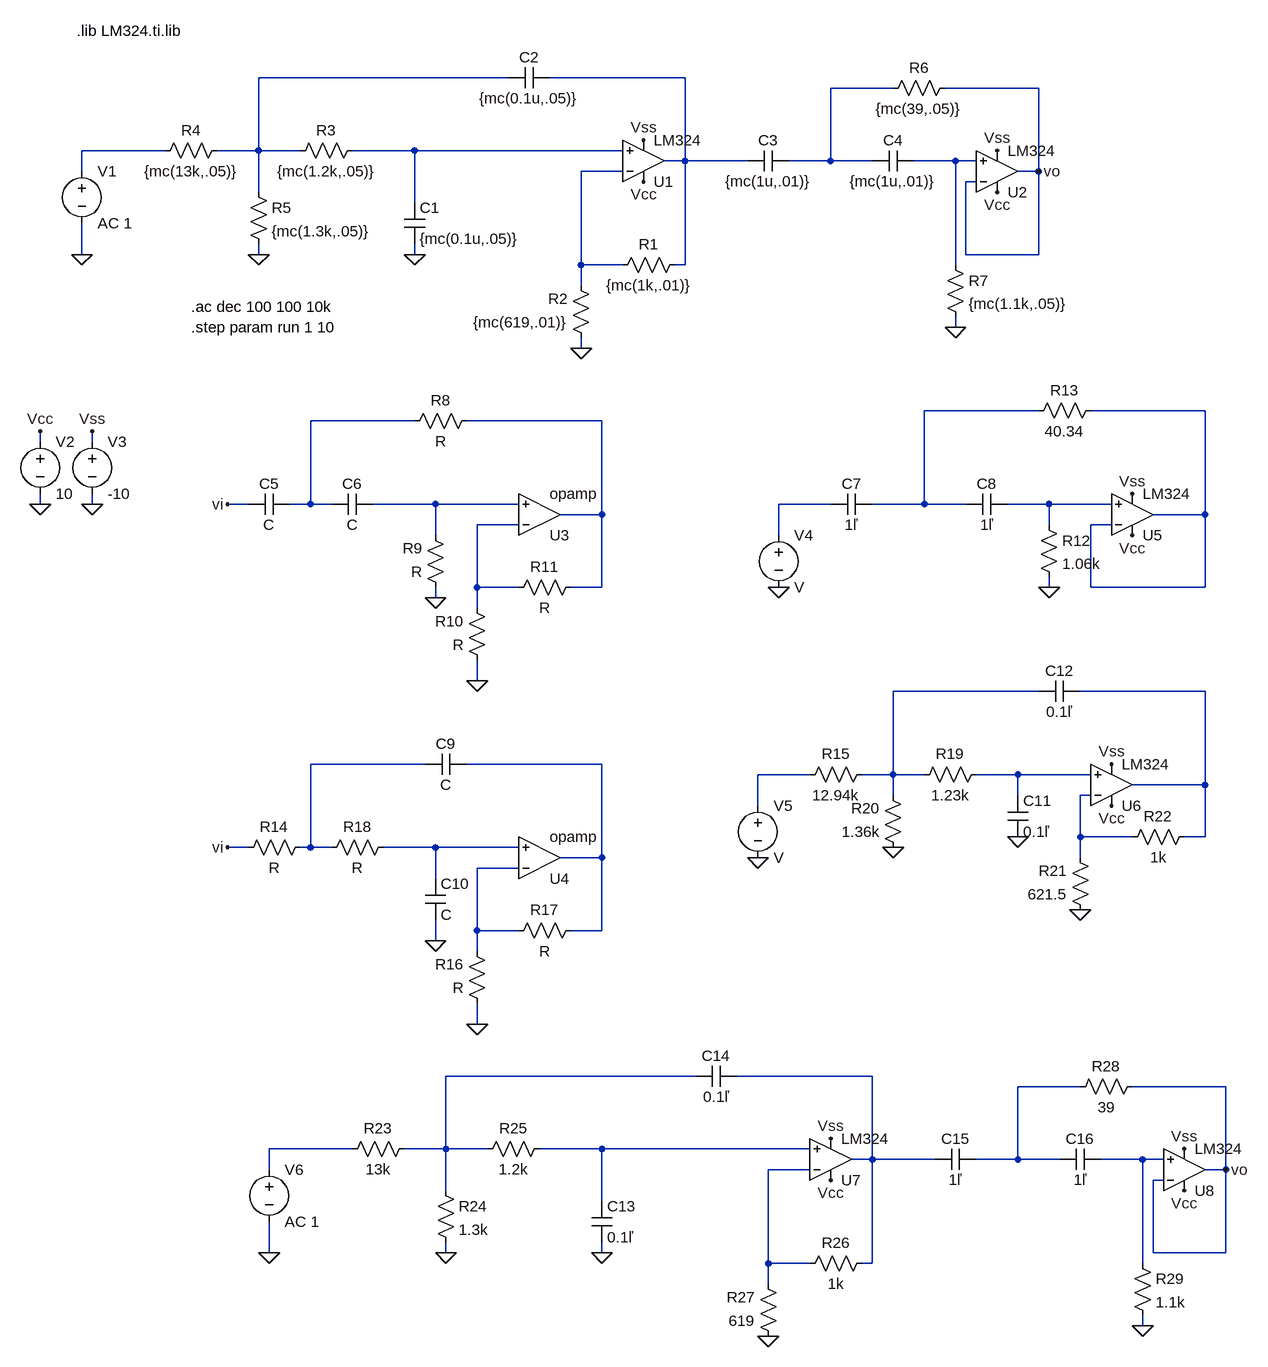
[diagram p0: schematic TP4_MORALES_SUAREZ_TORRES.asc]
TP4_MORALES_SUAREZ_TORRES.asc, the LTspice schematic file:
Version 4.1
SHEET 1 1472 2004
WIRE 176 48 -208 48
WIRE 448 48 240 48
WIRE 768 64 672 64
WIRE 992 64 848 64
WIRE -352 160 -480 160
WIRE -208 160 -208 48
WIRE -208 160 -272 160
WIRE -144 160 -208 160
WIRE 32 160 -64 160
WIRE 352 160 32 160
WIRE 448 176 448 48
WIRE 448 176 416 176
WIRE 544 176 448 176
WIRE 672 176 672 64
WIRE 672 176 608 176
WIRE 736 176 672 176
WIRE 864 176 800 176
WIRE 896 176 864 176
WIRE -480 192 -480 160
WIRE 352 192 288 192
WIRE 992 192 992 64
WIRE 992 192 960 192
WIRE 896 208 880 208
WIRE -208 224 -208 160
WIRE 32 240 32 160
WIRE -480 320 -480 272
WIRE -208 320 -208 304
WIRE 32 320 32 304
WIRE 880 320 880 208
WIRE 992 320 992 192
WIRE 992 320 880 320
WIRE 288 336 288 192
WIRE 352 336 288 336
WIRE 448 336 448 176
WIRE 448 336 432 336
WIRE 864 336 864 176
WIRE 288 368 288 336
WIRE 864 432 864 416
WIRE 288 464 288 448
WIRE 992 560 816 560
WIRE 1248 560 1072 560
WIRE 32 576 -128 576
WIRE 320 576 112 576
WIRE -544 608 -544 592
WIRE -464 608 -464 592
WIRE -544 704 -544 688
WIRE -464 704 -464 688
WIRE -224 704 -256 704
WIRE -128 704 -128 576
WIRE -128 704 -160 704
WIRE -96 704 -128 704
WIRE 64 704 -32 704
WIRE 192 704 64 704
WIRE 672 704 592 704
WIRE 816 704 816 560
WIRE 816 704 736 704
WIRE 880 704 816 704
WIRE 1008 704 944 704
WIRE 1104 704 1008 704
WIRE 320 720 320 576
WIRE 320 720 256 720
WIRE 1248 720 1248 560
WIRE 1248 720 1168 720
WIRE 192 736 128 736
WIRE 1008 736 1008 704
WIRE 1104 736 1072 736
WIRE 64 752 64 704
WIRE 592 752 592 704
WIRE 128 832 128 736
WIRE 192 832 128 832
WIRE 320 832 320 720
WIRE 320 832 272 832
WIRE 1008 832 1008 816
WIRE 1072 832 1072 736
WIRE 1248 832 1248 720
WIRE 1248 832 1072 832
WIRE 64 848 64 832
WIRE 128 864 128 832
WIRE 128 976 128 944
WIRE 992 992 768 992
WIRE 1248 992 1056 992
WIRE 48 1104 -128 1104
WIRE 320 1104 112 1104
WIRE 640 1120 560 1120
WIRE 768 1120 768 992
WIRE 768 1120 720 1120
WIRE 816 1120 768 1120
WIRE 960 1120 896 1120
WIRE 1072 1120 960 1120
WIRE 1248 1136 1248 992
WIRE 1248 1136 1136 1136
WIRE 768 1152 768 1120
WIRE 960 1152 960 1120
WIRE 1072 1152 1056 1152
WIRE 560 1168 560 1120
WIRE 1056 1216 1056 1152
WIRE 1136 1216 1056 1216
WIRE 1248 1216 1248 1136
WIRE 1248 1216 1216 1216
WIRE -224 1232 -256 1232
WIRE -128 1232 -128 1104
WIRE -128 1232 -144 1232
WIRE -96 1232 -128 1232
WIRE 64 1232 -16 1232
WIRE 192 1232 64 1232
WIRE 320 1248 320 1104
WIRE 320 1248 256 1248
WIRE 1056 1248 1056 1216
WIRE 192 1264 128 1264
WIRE 64 1280 64 1232
WIRE 128 1360 128 1264
WIRE 192 1360 128 1360
WIRE 320 1360 320 1248
WIRE 320 1360 272 1360
WIRE 64 1376 64 1344
WIRE 128 1392 128 1360
WIRE 128 1504 128 1472
WIRE 464 1584 80 1584
WIRE 736 1584 528 1584
WIRE 1056 1600 960 1600
WIRE 1280 1600 1136 1600
WIRE -64 1696 -192 1696
WIRE 80 1696 80 1584
WIRE 80 1696 16 1696
WIRE 144 1696 80 1696
WIRE 320 1696 224 1696
WIRE 640 1696 320 1696
WIRE 736 1712 736 1584
WIRE 736 1712 704 1712
WIRE 832 1712 736 1712
WIRE 960 1712 960 1600
WIRE 960 1712 896 1712
WIRE 1024 1712 960 1712
WIRE 1152 1712 1088 1712
WIRE 1184 1712 1152 1712
WIRE -192 1728 -192 1696
WIRE 640 1728 576 1728
WIRE 1280 1728 1280 1600
WIRE 1280 1728 1248 1728
WIRE 1184 1744 1168 1744
WIRE 80 1760 80 1696
WIRE 320 1776 320 1696
WIRE -192 1856 -192 1808
WIRE 80 1856 80 1840
WIRE 320 1856 320 1840
WIRE 1168 1856 1168 1744
WIRE 1280 1856 1280 1728
WIRE 1280 1856 1168 1856
WIRE 576 1872 576 1728
WIRE 640 1872 576 1872
WIRE 736 1872 736 1712
WIRE 736 1872 720 1872
WIRE 1152 1872 1152 1712
WIRE 576 1904 576 1872
WIRE 1152 1968 1152 1952
FLAG -544 704 0
FLAG -464 704 0
FLAG -208 320 0
FLAG -480 320 0
FLAG 32 320 0
FLAG 288 464 0
FLAG 864 432 0
FLAG 384 208 Vcc
FLAG 384 144 Vss
FLAG 928 224 Vcc
FLAG 928 160 Vss
FLAG -544 592 Vcc
FLAG -464 592 Vss
FLAG 992 192 vo
FLAG -256 704 vi
FLAG 128 976 0
FLAG 64 848 0
FLAG 592 832 0
FLAG 1008 832 0
FLAG 1136 752 Vcc
FLAG 1136 688 Vss
FLAG -256 1232 vi
FLAG 128 1504 0
FLAG 64 1376 0
FLAG 1056 1328 0
FLAG 768 1232 0
FLAG 960 1216 0
FLAG 1104 1168 Vcc
FLAG 1104 1104 Vss
FLAG 560 1248 0
FLAG 80 1856 0
FLAG -192 1856 0
FLAG 320 1856 0
FLAG 1152 1968 0
FLAG 672 1744 Vcc
FLAG 672 1680 Vss
FLAG 1216 1760 Vcc
FLAG 1216 1696 Vss
FLAG 1280 1728 vo
FLAG 576 1984 0
SYMBOL voltage -544 592 R0
SYMATTR InstName V2
SYMATTR Value 10
SYMBOL voltage -464 592 R0
SYMATTR InstName V3
SYMATTR Value -10
SYMBOL res -256 144 R90
WINDOW 0 0 56 VBottom 2
WINDOW 3 32 56 VTop 2
SYMATTR InstName R4
SYMATTR Value {mc(13k,.05)}
SYMBOL res -224 208 R0
SYMATTR InstName R5
SYMATTR Value {mc(1.3k,.05)}
SYMBOL res -48 144 R90
WINDOW 0 0 56 VBottom 2
WINDOW 3 32 56 VTop 2
SYMATTR InstName R3
SYMATTR Value {mc(1.2k,.05)}
SYMBOL cap 16 240 R0
SYMATTR InstName C1
SYMATTR Value {mc(0.1u,.05)}
SYMBOL cap 240 32 R90
WINDOW 0 0 32 VBottom 2
WINDOW 3 32 32 VTop 2
SYMATTR InstName C2
SYMATTR Value {mc(0.1u,.05)}
SYMBOL voltage -480 176 R0
SYMATTR InstName V1
SYMATTR Value AC 1
SYMBOL res 448 320 R90
WINDOW 0 0 56 VBottom 2
WINDOW 3 32 56 VTop 2
SYMATTR InstName R1
SYMATTR Value {mc(1k,.01)}
SYMBOL res 304 464 R180
WINDOW 0 36 76 Left 2
WINDOW 3 36 40 Left 2
SYMATTR InstName R2
SYMATTR Value {mc(619,.01)}
SYMBOL cap 608 160 R90
WINDOW 0 0 32 VBottom 2
WINDOW 3 32 32 VTop 2
SYMATTR InstName C3
SYMATTR Value {mc(1u,.01)}
SYMBOL cap 800 160 R90
WINDOW 0 0 32 VBottom 2
WINDOW 3 32 32 VTop 2
SYMATTR InstName C4
SYMATTR Value {mc(1u,.01)}
SYMBOL res 864 48 R90
WINDOW 0 0 56 VBottom 2
WINDOW 3 32 56 VTop 2
SYMATTR InstName R6
SYMATTR Value {mc(39,.05)}
SYMBOL res 848 320 R0
SYMATTR InstName R7
SYMATTR Value {mc(1.1k,.05)}
SYMBOL OpAmps\\opamp2 384 240 M180
SYMATTR InstName U1
SYMATTR Value LM324
SYMBOL OpAmps\\opamp2 928 256 M180
SYMATTR InstName U2
SYMATTR Value LM324
SYMBOL cap -160 688 R90
WINDOW 0 0 32 VBottom 2
WINDOW 3 32 32 VTop 2
SYMATTR InstName C5
SYMBOL cap -32 688 R90
WINDOW 0 0 32 VBottom 2
WINDOW 3 32 32 VTop 2
SYMATTR InstName C6
SYMBOL res 128 560 R90
WINDOW 0 0 56 VBottom 2
WINDOW 3 32 56 VTop 2
SYMATTR InstName R8
SYMBOL res 80 848 R180
WINDOW 0 36 76 Left 2
WINDOW 3 36 40 Left 2
SYMATTR InstName R9
SYMBOL res 144 960 R180
WINDOW 0 36 76 Left 2
WINDOW 3 36 40 Left 2
SYMATTR InstName R10
SYMBOL res 176 848 R270
WINDOW 0 32 56 VTop 2
WINDOW 3 0 56 VBottom 2
SYMATTR InstName R11
SYMBOL OpAmps\\opamp 224 784 M180
SYMATTR InstName U3
SYMBOL voltage 592 736 R0
SYMATTR InstName V4
SYMBOL cap 736 688 R90
WINDOW 0 0 32 VBottom 2
WINDOW 3 32 32 VTop 2
SYMATTR InstName C7
SYMATTR Value 1ľ
SYMBOL cap 944 688 R90
WINDOW 0 0 32 VBottom 2
WINDOW 3 32 32 VTop 2
SYMATTR InstName C8
SYMATTR Value 1ľ
SYMBOL res 992 720 R0
SYMATTR InstName R12
SYMATTR Value 1.06k
SYMBOL OpAmps\\opamp2 1136 784 M180
SYMATTR InstName U5
SYMATTR Value LM324
SYMBOL res 1088 544 R90
WINDOW 0 0 56 VBottom 2
WINDOW 3 32 56 VTop 2
SYMATTR InstName R13
SYMATTR Value 40.34
SYMBOL res 144 1488 R180
WINDOW 0 36 76 Left 2
WINDOW 3 36 40 Left 2
SYMATTR InstName R16
SYMBOL res 176 1376 R270
WINDOW 0 32 56 VTop 2
WINDOW 3 0 56 VBottom 2
SYMATTR InstName R17
SYMBOL OpAmps\\opamp 224 1312 M180
SYMATTR InstName U4
SYMBOL res -128 1216 R90
WINDOW 0 0 56 VBottom 2
WINDOW 3 32 56 VTop 2
SYMATTR InstName R14
SYMBOL res 0 1216 R90
WINDOW 0 0 56 VBottom 2
WINDOW 3 32 56 VTop 2
SYMATTR InstName R18
SYMBOL cap 112 1088 R90
WINDOW 0 0 32 VBottom 2
WINDOW 3 32 32 VTop 2
SYMATTR InstName C9
SYMBOL cap 48 1280 R0
SYMATTR InstName C10
SYMBOL voltage 560 1152 R0
SYMATTR InstName V5
SYMBOL res 736 1104 R90
WINDOW 0 0 56 VBottom 2
WINDOW 3 32 56 VTop 2
SYMATTR InstName R15
SYMATTR Value 12.94k
SYMBOL res 912 1104 R90
WINDOW 0 0 56 VBottom 2
WINDOW 3 32 56 VTop 2
SYMATTR InstName R19
SYMATTR Value 1.23k
SYMBOL res 784 1248 R180
WINDOW 0 36 76 Left 2
WINDOW 3 36 40 Left 2
SYMATTR InstName R20
SYMATTR Value 1.36k
SYMBOL res 1072 1344 R180
WINDOW 0 36 76 Left 2
WINDOW 3 36 40 Left 2
SYMATTR InstName R21
SYMATTR Value 621.5
SYMBOL res 1120 1232 R270
WINDOW 0 32 56 VTop 2
WINDOW 3 0 56 VBottom 2
SYMATTR InstName R22
SYMATTR Value 1k
SYMBOL cap 944 1152 R0
SYMATTR InstName C11
SYMATTR Value 0.1ľ
SYMBOL OpAmps\\opamp2 1104 1200 M180
SYMATTR InstName U6
SYMATTR Value LM324
SYMBOL cap 1056 976 R90
WINDOW 0 0 32 VBottom 2
WINDOW 3 32 32 VTop 2
SYMATTR InstName C12
SYMATTR Value 0.1ľ
SYMBOL res 32 1680 R90
WINDOW 0 0 56 VBottom 2
WINDOW 3 32 56 VTop 2
SYMATTR InstName R23
SYMATTR Value 13k
SYMBOL res 64 1744 R0
SYMATTR InstName R24
SYMATTR Value 1.3k
SYMBOL res 240 1680 R90
WINDOW 0 0 56 VBottom 2
WINDOW 3 32 56 VTop 2
SYMATTR InstName R25
SYMATTR Value 1.2k
SYMBOL cap 304 1776 R0
SYMATTR InstName C13
SYMATTR Value 0.1ľ
SYMBOL cap 528 1568 R90
WINDOW 0 0 32 VBottom 2
WINDOW 3 32 32 VTop 2
SYMATTR InstName C14
SYMATTR Value 0.1ľ
SYMBOL voltage -192 1712 R0
SYMATTR InstName V6
SYMATTR Value AC 1
SYMBOL res 736 1856 R90
WINDOW 0 0 56 VBottom 2
WINDOW 3 32 56 VTop 2
SYMATTR InstName R26
SYMATTR Value 1k
SYMBOL res 592 2000 R180
WINDOW 0 36 76 Left 2
WINDOW 3 36 40 Left 2
SYMATTR InstName R27
SYMATTR Value 619
SYMBOL cap 896 1696 R90
WINDOW 0 0 32 VBottom 2
WINDOW 3 32 32 VTop 2
SYMATTR InstName C15
SYMATTR Value 1ľ
SYMBOL cap 1088 1696 R90
WINDOW 0 0 32 VBottom 2
WINDOW 3 32 32 VTop 2
SYMATTR InstName C16
SYMATTR Value 1ľ
SYMBOL res 1152 1584 R90
WINDOW 0 0 56 VBottom 2
WINDOW 3 32 56 VTop 2
SYMATTR InstName R28
SYMATTR Value 39
SYMBOL res 1136 1856 R0
SYMATTR InstName R29
SYMATTR Value 1.1k
SYMBOL OpAmps\\opamp2 672 1776 M180
SYMATTR InstName U7
SYMATTR Value LM324
SYMBOL OpAmps\\opamp2 1216 1792 M180
SYMATTR InstName U8
SYMATTR Value LM324
TEXT -312 400 Left 2 !.ac dec 100 100 10k
TEXT -312 432 Left 2 !.step param run 1 10
TEXT -488 -24 Left 2 !.lib LM324.ti.lib

The netlist it stands for:
* TP4_MORALES_SUAREZ_TORRES.asc
V2 Vcc 0 10
V3 Vss 0 -10
R4 N001 N004 {mc(13k,.05)}
R5 N001 0 {mc(1.3k,.05)}
R3 N005 N001 {mc(1.2k,.05)}
C1 N005 0 {mc(0.1u,.05)}
C2 N002 N001 {mc(0.1u,.05)}
V1 N004 0 AC 1
R1 N002 N007 {mc(1k,.01)}
R2 0 N007 {mc(619,.01)}
C3 N003 N002 {mc(1u,.01)}
C4 N006 N003 {mc(1u,.01)}
R6 vo N003 {mc(39,.05)}
R7 N006 0 {mc(1.1k,.05)}
X§U1 N005 N007 Vcc Vss N002 LM324  ; pins In+ In- V+ V- OUT
X§U2 N006 vo Vcc Vss vo LM324  ; pins In+ In- V+ V- OUT
C5 N010 vi C
C6 N012 N010 C
R8 N011 N010 R
R9 0 N012 R
R10 0 N015 R
R11 N015 N011 R
X§U3 N015 N012 N011 opamp Aol=100K GBW=10Meg  ; pins invin noninvin out
V4 N013 0 V
C7 N008 N013 1ľ
C8 N014 N008 1ľ
R12 N014 0 1.06k
X§U5 N014 N009 Vcc Vss N009 LM324  ; pins In+ In- V+ V- OUT
R13 N009 N008 40.34
R16 0 N024 R
R17 N024 N019 R
X§U4 N024 N023 N019 opamp Aol=100K GBW=10Meg  ; pins invin noninvin out
R14 N018 vi R
R18 N023 N018 R
C9 N019 N018 C
C10 N023 0 C
V5 N020 0 V
R15 N016 N020 12.94k
R19 N021 N016 1.23k
R20 0 N016 1.36k
R21 0 N022 621.5
R22 N022 N017 1k
C11 N021 0 0.1ľ
X§U6 N021 N022 Vcc Vss N017 LM324  ; pins In+ In- V+ V- OUT
C12 N017 N016 0.1ľ
R23 N025 N028 13k
R24 N025 0 1.3k
R25 N029 N025 1.2k
C13 N029 0 0.1ľ
C14 N026 N025 0.1ľ
V6 N028 0 AC 1
R26 N026 N031 1k
R27 0 N031 619
C15 N027 N026 1ľ
C16 N030 N027 1ľ
R28 vo N027 39
R29 N030 0 1.1k
X§U7 N029 N031 Vcc Vss N026 LM324  ; pins In+ In- V+ V- OUT
X§U8 N030 vo Vcc Vss vo LM324  ; pins In+ In- V+ V- OUT
.ac dec 100 100 10k
.step param run 1 10
.lib LM324.ti.lib
.backanno
.end